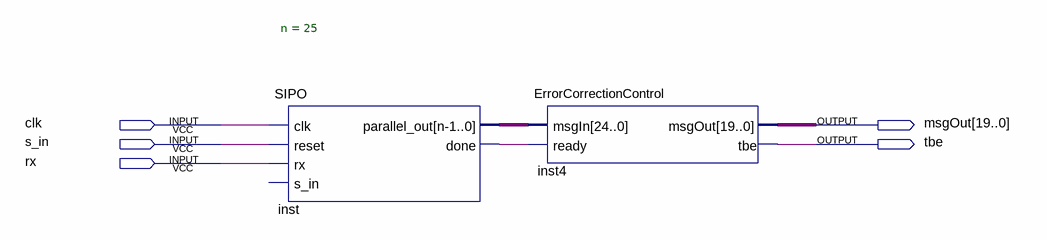
[diagram p0: schematic sheet]
// Quartus schematic Receiver.bdf as structural Verilog: 2 symbols, 5 pins
module Receiver (
  input  clk,
  input  s_in,
  input  rx,
  output [19:0] msgOut,
  output tbe
);

  wire inst_done;
  wire [24:0] inst_parallel_out;

  SIPO #(.n(25)) inst (
    .clk(clk), .reset(s_in), .rx(rx), .parallel_out(inst_parallel_out), .done(inst_done));  // open: s_in
  ErrorCorrectionControl inst4 (.msgIn(inst_parallel_out), .ready(inst_done), .msgOut(msgOut), .tbe(tbe));
endmodule
